# EAGLE schematic lcd13264-shield (EAGLE 6.5.0)
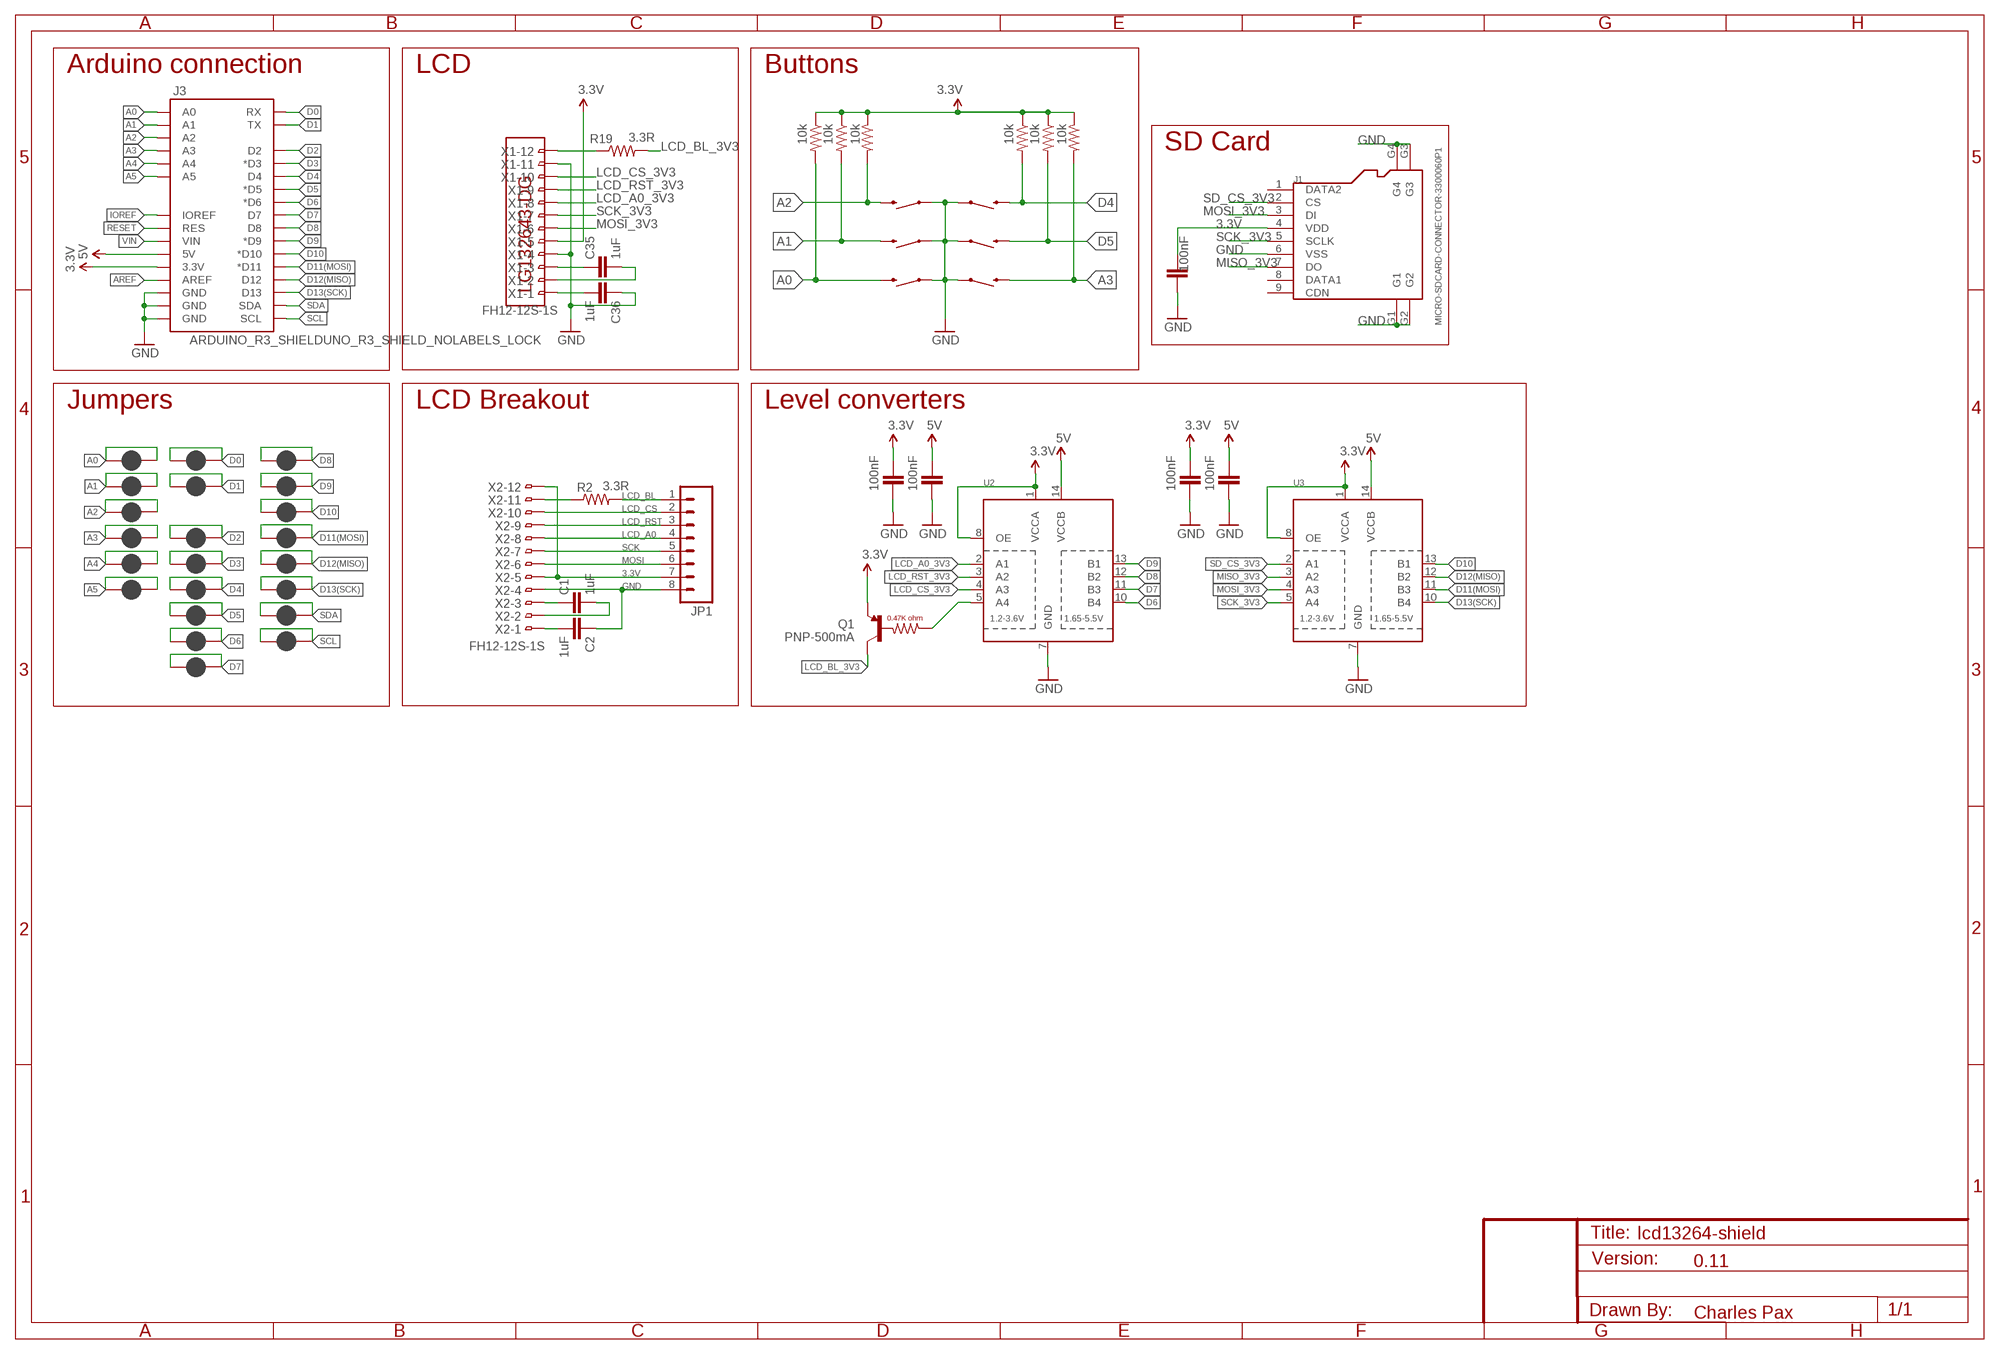
[diagram p0: schematic, sheet 1]

## Parts
C1  1uF  SPARKFUN-CAPACITORS_CAP1206  [SPARKFUN-CAPACITORS_1206]
C2  1uF  SPARKFUN-CAPACITORS_CAP1206  [SPARKFUN-CAPACITORS_1206]
C3  100nF  SPARKFUN-CAPACITORS_CAP1206  [SPARKFUN-CAPACITORS_1206]
C4  100nF  SPARKFUN-CAPACITORS_CAP1206  [SPARKFUN-CAPACITORS_1206]
C5  100nF  SPARKFUN-CAPACITORS_CAP1206  [SPARKFUN-CAPACITORS_1206]
C6  100nF  SPARKFUN-CAPACITORS_CAP1206  [SPARKFUN-CAPACITORS_1206]
C21  100nF  SPARKFUN-CAPACITORS_CAP1206  [SPARKFUN-CAPACITORS_1206]
C35  1uF  SPARKFUN-CAPACITORS_CAP1206  [SPARKFUN-CAPACITORS_1206]
C36  1uF  SPARKFUN-CAPACITORS_CAP1206  [SPARKFUN-CAPACITORS_1206]
J1  MICRO-SDCARD-CONNECTOR-3300060P1  [9P-SMD-W-RING]
J3  ARDUINO_R3_SHIELDUNO_R3_SHIELD_NOLABELS_LOCK  [UNO_R3_SHIELD_NOLABELS_LOCK]
JP1  M08  [1X08_ROUND]
Q1  PNP-500mA  TRANSISTOR-PNP-DDTB142TC  [SOT23-3]
R1  10k  SPARKFUN-RESISTORS_RESISTOR1206  [SPARKFUN-RESISTORS_1206]
R2  3.3R  SPARKFUN-RESISTORS_RESISTOR1206  [SPARKFUN-RESISTORS_1206]
R8  10k  SPARKFUN-RESISTORS_RESISTOR1206  [SPARKFUN-RESISTORS_1206]
R11  10k  SPARKFUN-RESISTORS_RESISTOR1206  [SPARKFUN-RESISTORS_1206]
R12  10k  SPARKFUN-RESISTORS_RESISTOR1206  [SPARKFUN-RESISTORS_1206]
R15  10k  SPARKFUN-RESISTORS_RESISTOR1206  [SPARKFUN-RESISTORS_1206]
R16  10k  SPARKFUN-RESISTORS_RESISTOR1206  [SPARKFUN-RESISTORS_1206]
R19  3.3R  SPARKFUN-RESISTORS_RESISTOR1206  [SPARKFUN-RESISTORS_1206]
S1  SWITCH-MOMENTARY-2SMD  [TACTILE_SWITCH_SMD]
S2  SWITCH-MOMENTARY-2SMD  [TACTILE_SWITCH_SMD]
S3  SWITCH-MOMENTARY-2SMD  [TACTILE_SWITCH_SMD]
S4  SWITCH-MOMENTARY-2SMD  [TACTILE_SWITCH_SMD]
S5  SWITCH-MOMENTARY-2SMD  [TACTILE_SWITCH_SMD]
S6  SWITCH-MOMENTARY-2SMD  [TACTILE_SWITCH_SMD]
SJ1  JUMPER-PAD-2-NC_BY_PASTE  [PAD-JUMPER-2-NC_BY_PASTE_YES_SILK]
SJ2  JUMPER-PAD-2-NC_BY_PASTE  [PAD-JUMPER-2-NC_BY_PASTE_YES_SILK]
SJ3  JUMPER-PAD-2-NC_BY_PASTE  [PAD-JUMPER-2-NC_BY_PASTE_YES_SILK]
SJ4  JUMPER-PAD-2-NC_BY_PASTE  [PAD-JUMPER-2-NC_BY_PASTE_YES_SILK]
SJ5  JUMPER-PAD-2-NC_BY_PASTE  [PAD-JUMPER-2-NC_BY_PASTE_YES_SILK]
SJ6  JUMPER-PAD-2-NC_BY_PASTE  [PAD-JUMPER-2-NC_BY_PASTE_YES_SILK]
SJ7  JUMPER-PAD-2-NC_BY_PASTE  [PAD-JUMPER-2-NC_BY_PASTE_YES_SILK]
SJ8  JUMPER-PAD-2-NC_BY_PASTE  [PAD-JUMPER-2-NC_BY_PASTE_YES_SILK]
SJ9  JUMPER-PAD-2-NC_BY_PASTE  [PAD-JUMPER-2-NC_BY_PASTE_YES_SILK]
SJ10  JUMPER-PAD-2-NC_BY_PASTE  [PAD-JUMPER-2-NC_BY_PASTE_YES_SILK]
SJ11  JUMPER-PAD-2-NC_BY_PASTE  [PAD-JUMPER-2-NC_BY_PASTE_YES_SILK]
SJ12  JUMPER-PAD-2-NC_BY_PASTE  [PAD-JUMPER-2-NC_BY_PASTE_YES_SILK]
SJ13  JUMPER-PAD-2-NC_BY_PASTE  [PAD-JUMPER-2-NC_BY_PASTE_YES_SILK]
SJ14  JUMPER-PAD-2-NC_BY_PASTE  [PAD-JUMPER-2-NC_BY_PASTE_YES_SILK]
SJ19  JUMPER-PAD-2-NC_BY_PASTE  [PAD-JUMPER-2-NC_BY_PASTE_YES_SILK]
SJ20  JUMPER-PAD-2-NC_BY_PASTE  [PAD-JUMPER-2-NC_BY_PASTE_YES_SILK]
SJ21  JUMPER-PAD-2-NC_BY_PASTE  [PAD-JUMPER-2-NC_BY_PASTE_YES_SILK]
SJ22  JUMPER-PAD-2-NC_BY_PASTE  [PAD-JUMPER-2-NC_BY_PASTE_YES_SILK]
SJ23  JUMPER-PAD-2-NC_BY_PASTE  [PAD-JUMPER-2-NC_BY_PASTE_YES_SILK]
SJ24  JUMPER-PAD-2-NC_BY_PASTE  [PAD-JUMPER-2-NC_BY_PASTE_YES_SILK]
SJ25  JUMPER-PAD-2-NC_BY_PASTE  [PAD-JUMPER-2-NC_BY_PASTE_YES_SILK]
SJ26  JUMPER-PAD-2-NC_BY_PASTE  [PAD-JUMPER-2-NC_BY_PASTE_YES_SILK]
U2  TXB0104PWRSOIC14  [SO14]
U3  TXB0104PWRSOIC14  [SO14]
U$5  LG132643-DG  [LG132643-DG]
X1  FH12-12S-1S  [FH12-12S-1SH]
X2  FH12-12S-1S  [FH12-12S-1SH]

## Nets
3.3V: C3.2 C5.2 C21.2 J1.4(VDD) J3.3.3V Q1.2(E) R1.1 R8.1 R11.1 R12.1 R15.1 R16.1 U2.1(VCCA) U2.8(OE) U3.1(VCCA) U3.8(OE) X1.5
5V: C4.2 C6.2 J3.5V U2.14(VCCB) U3.14(VCCB)
A0: J3.A0 R1.2 S6.3 SJ10.1 SJ10.2
A1: J3.A1 R16.2 S5.3 SJ7.1 SJ7.2
A2: J3.A2 R15.2 S4.3 SJ11.1 SJ11.2
A3: J3.A3 R12.2 S1.3 SJ12.1 SJ12.2
A4: J3.A4 SJ13.1 SJ13.2
A5: J3.A5 SJ14.1 SJ14.2
AREF: J3.AREF
D0: J3.RX SJ8.1 SJ8.2
D1: J3.TX SJ9.1 SJ9.2
D2: J3.D2 SJ3.1 SJ3.2
D3: J3.D3(*D3) SJ4.1 SJ4.2
D4: J3.D4 R8.2 S3.3 SJ5.1 SJ5.2
D5: J3.D5(*D5) R11.2 S2.3 SJ6.1 SJ6.2
D6: J3.D6(*D6) SJ19.1 SJ19.2 U2.10(B4)
D7: J3.D7 SJ20.1 SJ20.2 U2.11(B3)
D8: J3.D8 SJ21.1 SJ21.2 U2.12(B2)
D9: J3.D9(*D9) SJ22.1 SJ22.2 U2.13(B1)
D10: J3.D10(*D10) SJ23.1 SJ23.2 U3.13(B1)
D11(MOSI): J3.D11(*D11) SJ24.1 SJ24.2 U3.11(B3)
D12(MISO): J3.D12 SJ25.1 SJ25.2 U3.12(B2)
D13(SCK): J3.D13 SJ26.1 SJ26.2 U3.10(B4)
GND: C2.1 C3.1 C4.1 C5.1 C6.1 C21.1 C36.1 J1.6(VSS) J1.G1 J1.G2 J1.G3 J1.G4 J3.GND@0(GND) J3.GND@1(GND) J3.GND@2(GND) JP1.8 S1.1 S2.1 S3.1 S4.1 S5.1 S6.1 U2.7(GND) U3.7(GND) X1.4 X1.11 X2.4
IOREF: J3.IOREF
LCD_A0_3V3: U2.2(A1) X1.8
LCD_BL_3V3: Q1.3(C) R19.2
LCD_CS_3V3: U2.4(A3) X1.10
LCD_RST_3V3: U2.3(A2) X1.9
MISO_3V3: J1.7(DO) U3.3(A2)
MOSI_3V3: J1.3(DI) U3.4(A3) X1.6
N$4: R19.1 X1.12
N$37: C35.1 X1.3
N$38: C35.2 X1.2
N$39: C36.2 X1.1
N$40: C1.1 X2.3
N$41: C1.2 X2.2
N$42: C2.2 X2.1
N$43: R2.1 X2.11
N$47: JP1.7 X2.5 X2.12
N$51: JP1.1 R2.2
N$52: JP1.2 X2.10
N$53: JP1.3 X2.9
N$54: JP1.4 X2.8
N$55: JP1.5 X2.7
N$56: JP1.6 X2.6
N$57: Q1.1(B) U2.5(A4)
RESET: J3.RES
SCK_3V3: J1.5(SCLK) U3.5(A4) X1.7
SCL: J3.SCL SJ2.1 SJ2.2
SD_CS_3V3: J1.2(CS) U3.2(A1)
SDA: J3.SDA SJ1.1 SJ1.2
VIN: J3.VIN
Unconnected: J1.1(DATA2) J1.8(DATA1) J1.9(CDN)

## Notes on the sheet
- Arduino connection | LCD | Buttons
- SD Card
- Jumpers | LCD Breakout | Level converters
- LCD_BL
- LCD_CS
- LCD_RST
- LCD_A0
- SCK
- MOSI
- 3.3V
- GND
- 0.11
- Charles Pax

## Library data of the parts
C1 C2 C35 C36 = PaxInstrument-T400:SPARKFUN-CAPACITORS_CAP: Capacitor Standard 0603 ceramic capacitor, and 0.1" leaded capacitor.; MPN: LMK107B7105KA-T; OC_DIGIKEY: 587-1242-2-ND
C3-C6 C21 = PaxInstrument-T400:SPARKFUN-CAPACITORS_CAP: Capacitor Standard 0603 ceramic capacitor, and 0.1" leaded capacitor.; MPN: CL10B104KO8NNNC; OC_DIGIKEY: 1276-1005-2-ND
J1 = PaxInstrument-T400:MICRO-SDCARD-CONNECTOR: Micro SD Card
J3 = SparkFun-Boards:ARDUINO_R3_SHIELD: Shield form compatible with the Arduino Uno R3.
JP1 = SparkFun-Connectors:M08: Header 8 Standard 8-pin 0.1" header. Use with straight break away headers (SKU : PRT-00116), right angle break away headers (PRT-00553), swiss pins (PRT-00743), machine pins (PRT-00117), and female headers (PRT-00115).
Q1 = SparkFun-DiscreteSemi:TRANSISTOR-PNP-DDTB142TC: PNP transistor with base resistor.; PROD_ID: TRANS-11479
R1 R8 R11 R12 R15 R16 = PaxInstrument-T400:SPARKFUN-RESISTORS_RESISTOR: Resistor Basic schematic elements and footprints for 0603, 1206, and PTH resistors.; MPN: RC1608J103CS; OC_DIGIKEY: 1276-5086-2-ND
R2 R19 = PaxInstrument-T400:SPARKFUN-RESISTORS_RESISTOR: Resistor Basic schematic elements and footprints for 0603, 1206, and PTH resistors.
S1-S6 = SparkFun-Electromechanical:SWITCH-MOMENTARY-2: Various NO switches- pushbuttons, reed, etc
SJ1-SJ14 SJ19-SJ26 = SparkFun-Passives:JUMPER-PAD-2-NC_BY_PASTE
U2 U3 = SparkFun-DigitalIC:TXB0104PWR: 4-Bit Bi-Directional Level Shifter 1.2V-3.6V (VCCA) to 1.65V-5.5V (VCCB) bi-directional level shifter with auto direction sensing. Max data rate - VCCA 1.8V: 20Mbps (50ns), VCCA 3.3V: 100Mbps (10ns) Digikey: 296-21929-1-ND (TSSOP) IC-11329; PROD_ID: IC-11329
U$5 = charlespax:LG132643-DG; MPN: LG132643-DW
X1 X2 = PaxInstrument-T400:FH12-12S-1S

## Net classes
0 default: width 0.203 mm, drill 0.33 mm
1 power: width 0.305 mm